# Altium project kxtj3-1057_Driver_PCB.PrjPcb
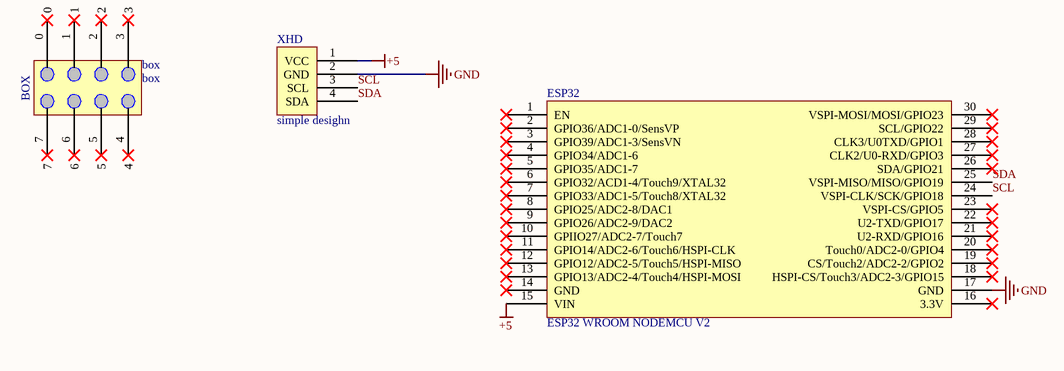
[diagram p0: pcb v1.SchDoc]
1 sheet, 3 parts. Net scope: global (net labels, ports and power ports of the same name join across sheets).
Board file: pcb v1.PcbDoc

## Sheet pcb v1.SchDoc
size A; SheetNumber: 1; SheetTotal: 1

### Parts
box  box  [BOX]
ESP32  ESP32 WROOM NODEMCU V2  [ESP32]
XHD  simple desighn  [PORT]

### Nets
+5: ESP32.15(VIN) XHD.1(VCC)
GND: ESP32.17(GND) XHD.2(GND)
SCL: ESP32.24(VSPI-CLK/SCK/GPIO18) XHD.3(SCL)
SDA: ESP32.25(VSPI-MISO/MISO/GPIO19) XHD.4(SDA)

Not connected (* = marked no-connect by the designer): box 0 1 2 3 4 5 6 7; ESP32 1(EN)* 2(GPIO36/ADC1-0/SensVP)* 3(GPIO39/ADC1-3/SensVN)* 4(GPIO34/ADC1-6)* 5(GPIO35/ADC1-7)* 6(GPIO32/ACD1-4/Touch9/XTAL32)* 7(GPIO33/ADC1-5/Touch8/XTAL32)* 8(GPIO25/ADC2-8/DAC1)* 9(GPIO26/ADC2-9/DAC2)* 10(GPIIO27/ADC2-7/Touch7)* 11(GPIO14/ADC2-6/Touch6/HSPI-CLK)* 12(GPIO12/ADC2-5/Touch5/HSPI-MISO)* 13(GPIO13/ADC2-4/Touch4/HSPI-MOSI)* 14(GND)* 16(3.3V)* 18(HSPI-CS/Touch3/ADC2-3/GPIO15)* 19(CS/Touch2/ADC2-2/GPIO2)* 20(Touch0/ADC2-0/GPIO4)* 21(U2-RXD/GPIO16)* 22(U2-TXD/GPIO17)* 23(VSPI-CS/GPIO5)* 26(SDA/GPIO21)* 27(CLK2/U0-RXD/GPIO3)* 28(CLK3/U0TXD/GPIO1)* 29(SCL/GPIO22)* 30(VSPI-MOSI/MOSI/GPIO23)*

### Notes on the sheet
- (in symbol box) BOX

### Library data of the parts
XHD = XHD